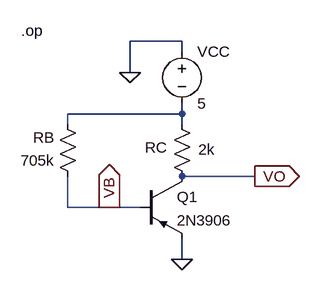
[diagram p0: schematic fig6_14a_1DC-voltage_source.asc]
fig6_14a_1DC-voltage_source.asc, the LTspice schematic file:
Version 4
SHEET 1 880 680
WIRE 256 -96 176 -96
WIRE 256 -80 256 -96
WIRE 176 -48 176 -96
WIRE 256 16 256 0
WIRE 256 16 80 16
WIRE 80 32 80 16
WIRE 256 32 256 16
WIRE 368 112 256 112
WIRE 80 160 80 112
WIRE 144 160 80 160
WIRE 192 160 144 160
WIRE 256 240 256 208
FLAG 256 240 0
FLAG 176 -48 0
FLAG 368 112 VO
IOPIN 368 112 Out
FLAG 144 160 VB
IOPIN 144 160 Out
SYMBOL pnp 192 112 R0
SYMATTR InstName Q1
SYMATTR Value 2N3906
SYMBOL res 240 16 R0
WINDOW 0 -41 52 Left 2
WINDOW 3 41 55 Left 2
SYMATTR InstName RC
SYMATTR Value 2k
SYMBOL res 96 128 R180
WINDOW 0 36 76 Left 2
WINDOW 3 36 40 Left 2
SYMATTR InstName RB
SYMATTR Value 705k
SYMBOL voltage 256 -96 R0
SYMATTR InstName VCC
SYMATTR Value 5
TEXT 8 -112 Left 2 !.op

The netlist it stands for:
* fig6_14a_1DC-voltage_source.asc
Q1 VO VB 0 0 2N3906
RC N001 VO 2k
RB VB N001 705k
VCC 0 N001 5
.model NPN NPN
.model PNP PNP
.lib standard.bjt
.op
.backanno
.end